# EAGLE design SI570_vcxo_draft1 (EAGLE 7.5.0)
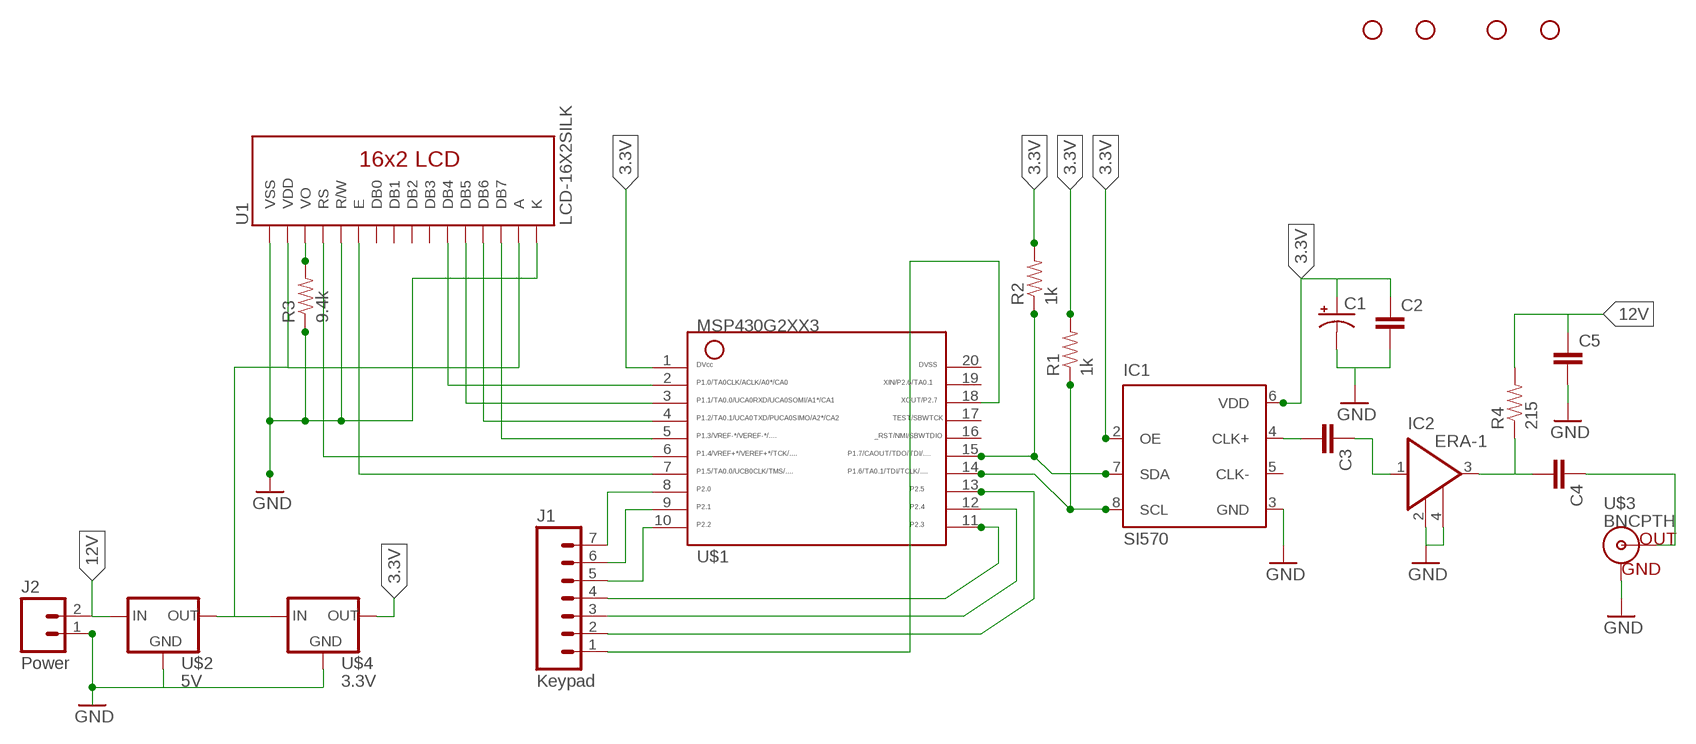
[diagram p0: schematic, sheet 1]

## Parts
C1  100UF-25V-20%(PTH)  [CPOL-RADIAL-100UF-25V]
C2  CAP0603-CAP  [0603-CAP]
C3  CAP0603-CAP  [0603-CAP]
C4  CAP0603-CAP  [0603-CAP]
C5  CAP0603-CAP  [0603-CAP]
H1  STAND-OFF  [STAND-OFF]
H2  STAND-OFF  [STAND-OFF]
H3  STAND-OFF  [STAND-OFF]
H4  STAND-OFF  [STAND-OFF]
IC1  SI570  [8-PIN]
IC2  ERA-1  [VV]
J1  Keypad  M07  [1X07]
J2  Power  M02PTH  [1X02]
R1  1k  RESISTOREZ  [AXIAL-0.3EZ]
R2  1k  RESISTOREZ  [AXIAL-0.3EZ]
R3  9.4k  RESISTOREZ  [AXIAL-0.3EZ]
R4  215  RESISTOREZ  [AXIAL-0.3EZ]
U1  LCD-16X2SILK  [LCD-16X2]
U$1  G2XX3---N20  [N20]
U$2  5V  LD1117V33  [LD1117V33]
U$3  BNCPTH  [BNC]
U$4  3.3V  LD1117V33  [LD1117V33]

## Nets
3.3V: C1.1(+) C2.1 IC1.2(OE) IC1.6(VDD) R1.P$2 R2.P$2 U$1.1 U$4.OUT
12V: C5.1 J2.2 R4.P$2 U$2.IN
GND: C1.2(-) C2.2 C5.2 IC1.3(GND) IC2.2(GND) IC2.4(GND) J2.1 R3.P$1 U1.1(VSS) U1.5(R/W) U1.16(K) U$2.GND U$3.GND U$4.GND
N$1: IC1.7(SDA) R2.P$1 U$1.15
N$2: IC1.8(SCL) R1.P$1 U$1.14
N$3: R3.P$2 U1.3(VO)
N$4: C4.2 IC2.3(RFOUT/DCIN) R4.P$1
N$5: U1.4(RS) U$1.6
N$6: C3.2 IC1.4(CLK+)
N$7: U1.6(E) U$1.7
N$8: U1.11(DB4) U$1.2
N$9: U1.12(DB5) U$1.3
N$10: U1.13(DB6) U$1.4
N$11: U1.14(DB7) U$1.5
N$12: J1.7 U$1.8
N$13: J1.6 U$1.9
N$15: J1.5 U$1.10
N$16: C3.1 IC2.1(RFIN)
N$17: J1.4 U$1.11
N$18: J1.3 U$1.12
N$19: J1.2 U$1.13
N$20: J1.1 U$1.18
N$23: C4.1 U$3.S(OUT)
N$24: U1.2(VDD) U1.15(A) U$2.OUT U$4.IN
Unconnected: IC1.5(CLK-) U1.7(DB0) U1.8(DB1) U1.9(DB2) U1.10(DB3) U$1.16 U$1.17 U$1.19 U$1.20

## Library data of the parts
C1 = SparkFun-Capacitors:100UF-25V-20%(PTH): CAP-08439; PROD_ID: CAP-08439
C2-C5 = SparkFun-Capacitors:CAP: Capacitor Standard 0603 ceramic capacitor, and 0.1" leaded capacitor.
H1-H4 = SparkFun-Electromechanical:STAND-OFF: #4 Stand Off This is the mechanical footprint for a #4 phillips button head screw. Use the keepout ring to avoid running the screw head into surrounding components. SKU : PRT-00447
IC1 = silabs:SI570: ANY-RATE I2C PROGRAMMABLE XO/VCXO Source: si570.pdf; OC_FARNELL: unknown; OC_NEWARK: unknown
IC2 = linear:ERA-*: MONOLITHIC AMPLIFIERS 50 Ohm BROADBAND DC to 8 GHz Source: Datasheet <http://www.mini-circuits.com/pdfs/ERA-3SM+.pdf>
J1 = SparkFun-Connectors:M07: Header 7 Standard 7-pin 0.1" header. Use with straight break away headers (SKU : PRT-00116), right angle break away headers (PRT-00553), swiss pins (PRT-00743), machine pins (PRT-00117), and female headers (PRT-00115). NOTES ON THE VARIANTS LOCK and LOCK_LONGPADS... This footprint was designed to help hold the alignment of a through-hole component (i.e. 7-pin header) while soldering it into place. You may notice that each hole has been shifted either up or down by 0.005 of an inch from it's more standard position (which is usually a perfectly straight line). This slight alteration caused the pins (the squares in the middle) to touch the edges of the holes. Because they are alternating, it causes a "brace" to hold the header in place. 0.005 has proven to be the perfect amount of "off-center" position when using our standard breakaway headers. Although looks a little odd when you look at the bare footprint, once you have a header in there, the alteration is very hard to notice. Also, if you push a header all the way into place, it is covered up entirely on the bottom side. This idea of altering the position of holes to aid alignment will be further integrated into the Sparkfun Library for other footprints. It can help hold any component with 3 or more connection pins.
J2 = SparkFun-Connectors:M02: Standard 2-pin 0.1" header. Use with - straight break away headers ( PRT-00116) - right angle break away headers (PRT-00553) - swiss pins (PRT-00743) - machine pins (PRT-00117) - female headers (PRT-00115) Molex polarized connector foot print use with: PRT-08233 with associated crimp pins and housings. 2.54_SCREWTERM for use with PRT-10571. 3.5mm Screw Terminal footprints for PRT-08084 5mm Screw Terminal footprints for use with PRT-08432
R1-R4 = SparkFun-Passives:RESISTOR: Resistor Basic schematic elements and footprints for 0603, 1206, and PTH resistors.
U1 = SparkFun-Displays:LCD-16X2: Standard text-only 16x2 parallel input LCD
U$1 = TI_MSP430_v16:G2XX3---N20: MSP430G2XX1 PDIP (N) 20 Pin Package
U$2 U$4 = LD1117V33:LD1117V33
U$3 = SparkFun-Connectors:BNC: BNC Connector, Mouser Part# 5227161

## Board
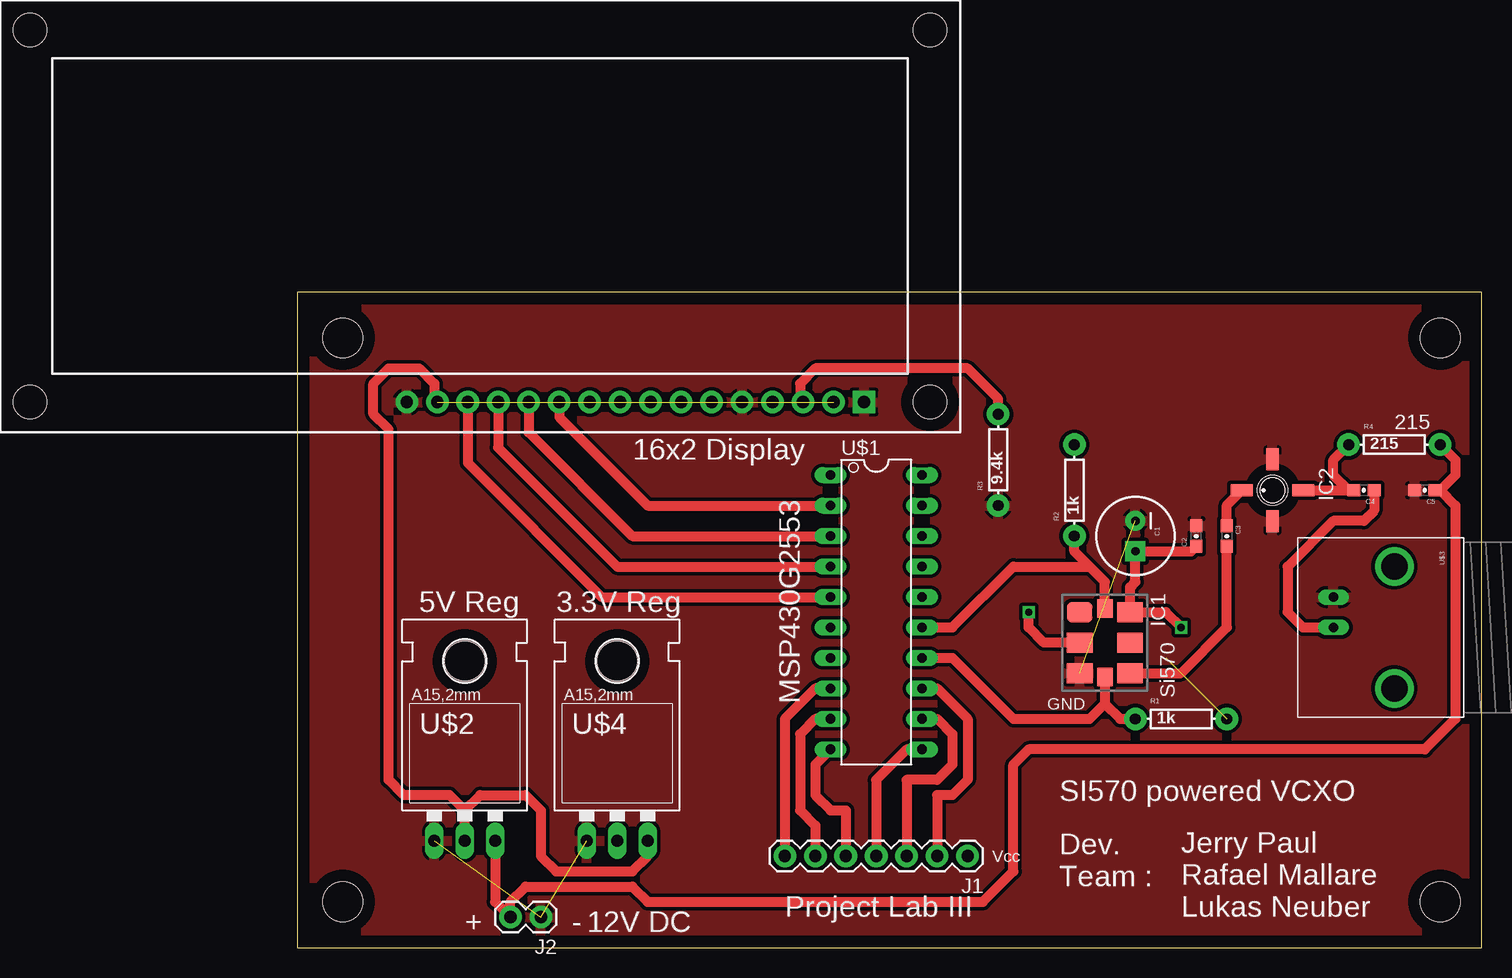
[diagram p1: board, top side]
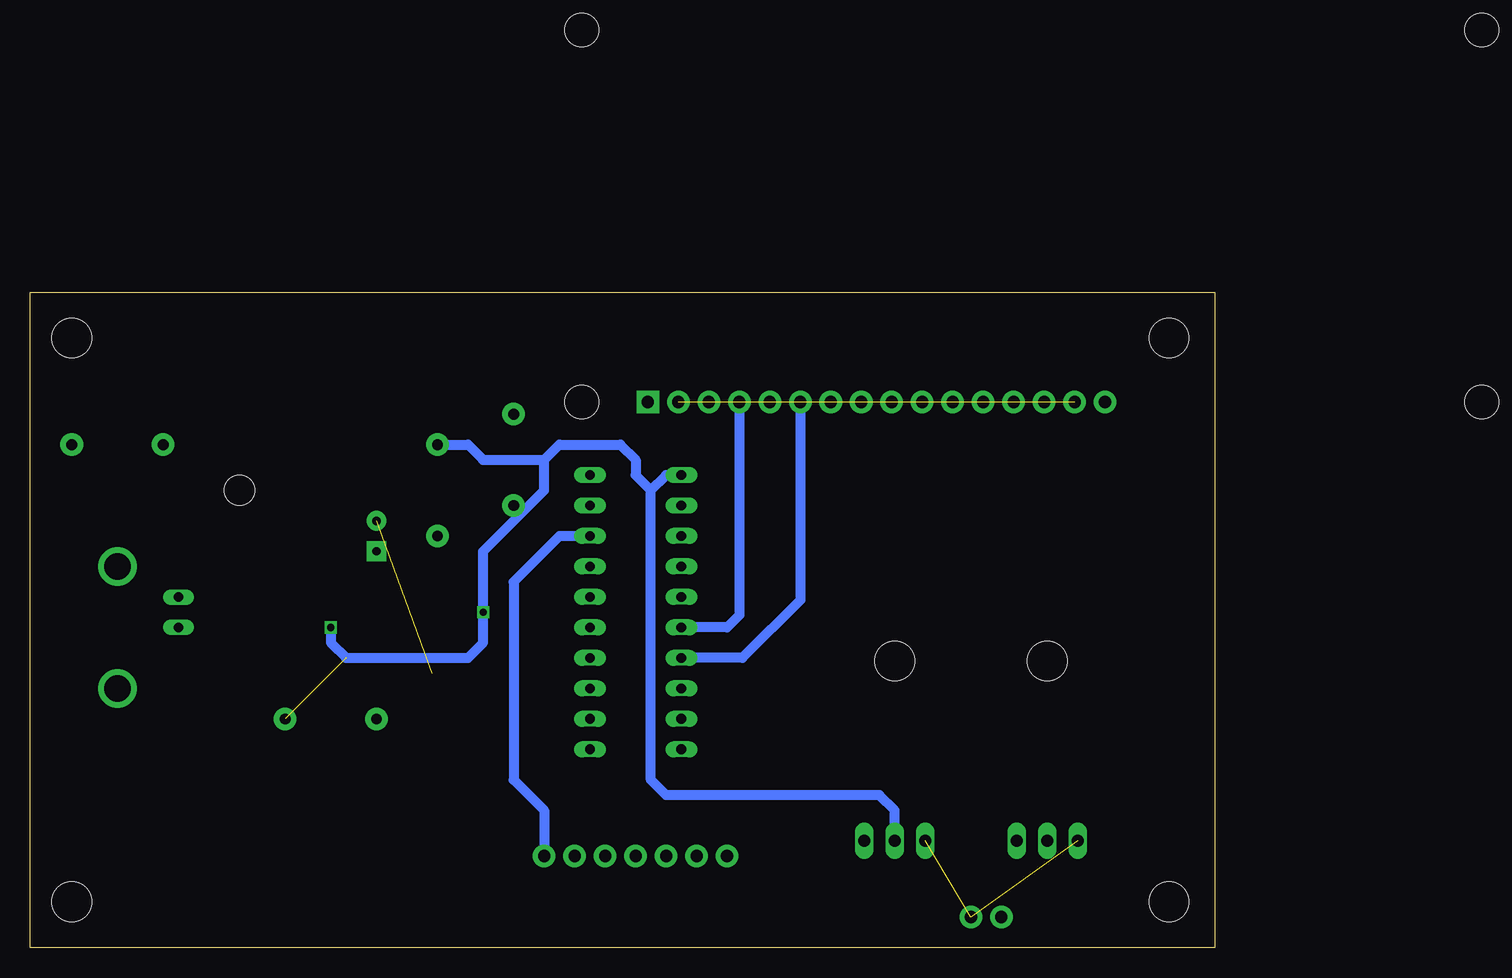
[diagram p2: board, bottom side, seen from below]

Size 98.73 x 54.6 mm. Coordinates in mm from the lower left corner, seen from the top.
Outline: 0,0 98.73,0 98.73,54.6 0,54.6 0,0
Copper layers (1*16): Top 0.035mm / dielectric 1.5mm / Bottom 0.035mm
Design rules "default": minimum track width 10mil, minimum drill 24mil, track to track 8mil, track to pad 8mil, pad to pad 8mil, via to via 8mil, smd to smd 8mil, copper to edge 40mil, drill to drill 8mil, minimum pad ring 10mil, minimum via ring 8mil, stop-mask expansion 4mil, vias tented up to drill 0mil, thermal gap 10mil

### Footprints (pad centres in the part's own frame; a part is rotated, then mirrored left to right if it is on the bottom)
CPOL-RADIAL-100UF-25V = drill 0.7 pad 1.651 square: 1 1.27,0 | drill 0.7 pad 1.651: 2 -1.27,0
0603-CAP = smd 1.1 x 1: 1 -0.85,0; 2 0.85,0
STAND-OFF = hole 3.302: 0,0
8-PIN = smd 1.7 x 2.15: 1 -2.54,-2.1; 2 0,-2.1; 3 2.54,-2.1; 4 2.54,2.1; 5 0,2.1; 6 -2.54,2.1 | smd 1.545 x 1.3: 7 -2.853,0; 8 2.853,0
VV = smd 1.02 x 1.83: 1 0,-2.575; 3 0,2.575 | smd 1.83 x 1.02: 2 2.575,0; 4 -2.575,0 | hole 2.5: 0,0
1X07 = drill 1.016 pad 1.88: 1 0,0; 2 2.54,0; 3 5.08,0; 4 7.62,0; 5 10.16,0; 6 12.7,0; 7 15.24,0
1X02 = drill 1.016 pad 1.88: 1 0,0; 2 2.54,0
AXIAL-0.3EZ = drill 0.9 pad 1.88: P$1 -3.81,0; P$2 3.81,0
LCD-16X2 = drill 1.016 pad 1.88 square: 1 -32,15.5 | drill 1.016 pad 1.88: 2 -29.46,15.5; 3 -26.92,15.5; 4 -24.38,15.5; 5 -21.84,15.5; 6 -19.3,15.5; 7 -16.76,15.5; 8 -14.22,15.5; 9 -11.68,15.5; 10 -9.14,15.5; 11 -6.6,15.5; 12 -4.06,15.5; 13 -1.52,15.5; 14 1.02,15.5; 15 3.56,15.5; 16 6.1,15.5 | hole 2.8: -37.5,15.5; -37.5,-15.5; 37.5,15.5; 37.5,-15.5
N20 = drill 0.813 long: 1 -11.435,-3.81; 2 -8.895,-3.81; 3 -6.355,-3.81; 4 -3.815,-3.81; 5 -1.275,-3.81; 6 1.265,-3.81; 7 3.805,-3.81; 8 6.345,-3.81; 9 8.885,-3.81; 10 11.425,-3.81; 11 11.425,3.81; 12 8.885,3.81; 13 6.345,3.81; 14 3.805,3.81; 15 1.265,3.81; 16 -1.275,3.81; 17 -3.815,3.81; 18 -6.355,3.81; 19 -8.895,3.81; 20 -11.435,3.81
LD1117V33 = drill 1.016 long: GND -2.54,-8.89; IN 2.54,-8.89; OUT 0,-8.89 | hole 3.302: 0,6.096
BNC = drill 2.2: 3 -5.08,5.08; 4 5.08,5.08 | drill 0.8 long: GND -2.54,0; S 0,0

### Placement (x,y rotation side)
C1  69.85,34.29 270 top
C2  74.93,34.29 90 top
C3  77.47,34.29 270 top
C4  88.9,38.1 180 top
C5  93.98,38.1 180 top
H1  3.81,3.81 0 top
H2  3.81,50.8 0 top
H3  95.25,3.81 0 top
H4  95.25,50.8 0 top
IC1  67.31,25.4 270 top
IC2  81.28,38.1 270 top
J1  55.88,7.62 180 top
J2  20.32,2.54 180 top
R1  73.66,19.05 0 top
R2  64.77,38.1 90 top
R3  58.42,40.64 90 top
R4  91.44,41.91 0 top
U1  15.24,60.96 180 top
U$1  48.26,27.94 270 top
U$2  13.97,17.78 0 top
U$3  86.36,26.67 270 top
U$4  26.67,17.78 0 top

### Tracks (layer width: path | path; a pad name or v marks a point on that pad's centre or on a via)
3.3V  (via drill 0.6)  (1 unrouted)
  Top 0.813: C2.1 74.51,33.02 C1.1 69.85,30.48 69.41,30.04 IC1.6 72.39,27.94 v73.66,26.67 | IC1.2 62.23,25.4 60.96,26.67 v60.96,27.94
  Bottom 0.813: U$4.OUT 26.67,11.43 27.94,12.7 45.72,12.7 46.99,13.97 46.99,38.1 | 46.99,38.1 45.72,39.37 U$1.1 | 55.88,40.64 55.88,38.1 60.96,33.02 v60.96,27.94 60.96,25.4 62.23,24.13 72.39,24.13 73.66,25.4 v73.66,26.67 | 55.88,40.64 54.61,41.91 49.53,41.91 48.26,40.64 48.26,39.37 46.99,38.1 | R2.P$2 62.23,41.91 60.96,40.64 55.88,40.64
12V
  Top 0.813: R4.P$2 96.52,40.64 96.52,39.37 95.25,38.1 | C5.1 95.25,38.1 | 95.25,38.1 96.52,36.83 96.52,19.05 93.98,16.51 60.96,16.51 59.69,15.24 59.69,6.35 57.15,3.81 29.21,3.81 27.94,5.08 19.05,5.08 17.78,3.81 J2.2 16.51,3.81 U$2.IN
GND  (3 unrouted)
  pour Top (isolate 0.305): 0,54.61 99.06,54.61 99.06,0 0,0
N$1
  Top 0.813: U$1.15 54.6,26.68 54.61,26.67 59.69,31.75 66.04,31.75 | IC1.7 67.31,30.48 66.04,31.75 | 66.04,31.75 64.77,33.02 R2.P$1
N$2
  Top 0.813: U$1.14 54.6,24.14 59.69,19.05 66.04,19.05 67.31,20.32 | IC1.8 67.31,20.32 | 67.31,20.32 68.58,19.05 R1.P$1
N$3
  Top 0.813: R3.P$2 58.42,45.72 55.88,48.26 43.18,48.26 41.91,46.99 41.91,45.71 U1.3
N$4
  Top 0.813: IC2.3 C4.2 87.63,38.1 86.36,39.37 86.36,40.64 R4.P$1
N$5
  Bottom 0.813: U$1.6 40.64,26.67 40.01,27.3 39.62,27.69 U1.4
N$6
  Top 0.813: IC1.4 73.66,22.86 77.47,26.67 C3.2
N$7
  Bottom 0.813: U$1.7 39.37,24.13 34.54,28.96 U1.6
N$8
  Top 0.813: U1.11 21.85,44.19 29.21,36.83 U$1.2
N$9
  Top 0.813: U$1.3 27.94,34.29 19.3,42.93 U1.12
N$10
  Top 0.813: U$1.4 26.67,31.75 16.76,41.66 U1.13
N$11
  Top 0.813: U$1.5 25.4,29.21 14.22,40.39 U1.14
N$12
  Top 0.813: U$1.8 43.19,21.59 40.64,19.05 J1.7
N$13
  Top 0.813: U$1.9 43.19,19.05 41.91,17.78 41.91,11.43 43.18,10.16 J1.6
N$15
  Top 0.813: U$1.10 43.18,15.24 43.18,12.7 44.45,11.43 45.72,11.43 J1.5
N$16
  Top 0.813: C3.1 77.47,36.87 IC2.1
N$17
  Top 0.813: U$1.11 50.8,16.52 48.26,13.97 J1.4
N$18
  Top 0.813: U$1.12 53.34,19.05 54.61,17.78 54.61,15.24 53.34,13.97 50.8,13.97 J1.3
N$19
  Top 0.813: U$1.13 53.34,21.59 55.88,19.05 55.88,13.97 54.61,12.7 53.34,12.7 J1.2
N$20
  Bottom 0.813: U$1.18 54.61,34.29 58.42,30.48 58.42,13.97 55.88,11.43 J1.1
N$23
  Top 0.813: C4.1 89.75,36.41 88.9,35.56 86.36,35.56 82.55,31.75 82.55,27.94 83.82,26.67 U$3.S
N$24  (1 unrouted)
  Top 0.813: U$2.OUT 13.97,11.43 | 13.97,11.43 15.24,12.7 19.05,12.7 20.32,11.43 20.32,7.62 21.59,6.35 27.94,6.35 29.21,7.62 U$4.IN | 13.97,11.43 12.7,12.7 8.89,12.7 7.62,13.97 7.62,43.18 6.35,44.45 6.35,46.99 7.62,48.26 10.16,48.26 11.43,46.99 11.43,45.71 U1.15

### Text on the board
tPlace: 215 | 16x2 Display | GND | SI570 powered VCXO | Vcc | Dev. / Team : | Project Lab III | Jerry Paul / Rafael Mallare / Lukas Neuber | + | - | 12V DC
tNames: 5V Reg | 3.3V Reg | Si570 | MSP430G2553